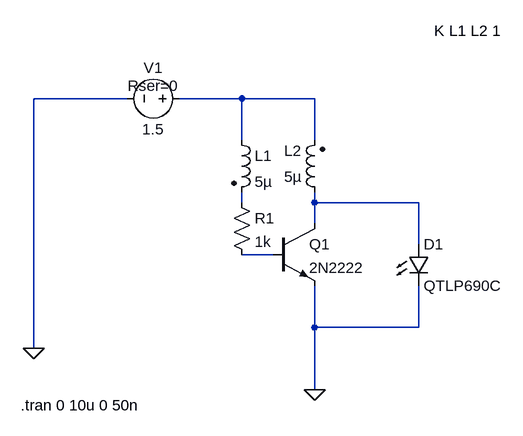
[diagram p0: schematic Draft1.asc]
Draft1.asc, the LTspice schematic file:
Version 4
SHEET 1 880 680
WIRE 96 -64 -48 -64
WIRE 272 -64 176 -64
WIRE 384 -64 272 -64
WIRE 272 0 272 -64
WIRE 384 0 384 -64
WIRE 272 96 272 80
WIRE 384 96 384 80
WIRE 544 96 384 96
WIRE 384 128 384 96
WIRE 544 160 544 96
WIRE 320 176 272 176
WIRE 384 288 384 224
WIRE 544 288 544 224
WIRE 544 288 384 288
WIRE -48 320 -48 -64
WIRE 384 384 384 288
FLAG -48 320 0
FLAG 384 384 0
SYMBOL npn 320 128 R0
SYMATTR InstName Q1
SYMATTR Value 2N2222
SYMBOL ind2 256 -16 R0
SYMATTR InstName L1
SYMATTR Value 5µ
SYMATTR Type ind
SYMBOL ind2 400 96 R180
WINDOW 0 36 80 Left 2
WINDOW 3 36 40 Left 2
SYMATTR InstName L2
SYMATTR Value 5µ
SYMATTR Type ind
SYMBOL voltage 192 -64 R90
WINDOW 0 -32 56 VBottom 2
WINDOW 3 32 56 VTop 2
WINDOW 123 0 0 Left 0
WINDOW 39 -4 56 VBottom 2
SYMATTR InstName V1
SYMATTR Value 1.5
SYMATTR SpiceLine Rser=0
SYMBOL res 256 80 R0
SYMATTR InstName R1
SYMATTR Value 1k
SYMBOL LED 528 160 R0
SYMATTR InstName D1
SYMATTR Value QTLP690C
TEXT 568 -168 Left 2 !K L1 L2 1
TEXT -68 408 Left 2 !.tran 0 10u 0 50n

The netlist it stands for:
* Draft1.asc
Q1 N003 N004 0 0 2N2222
L1 N001 N002 5µ
L2 N003 N001 5µ
V1 N001 0 1.5 Rser=0
R1 N002 N004 1k
D1 N003 0 QTLP690C
.model D D
.lib standard.dio
.model NPN NPN
.model PNP PNP
.lib standard.bjt
K L1 L2 1
.tran 0 10u 0 50n
.backanno
.end